# EAGLE design roco1044 (EAGLE 9.5.2)
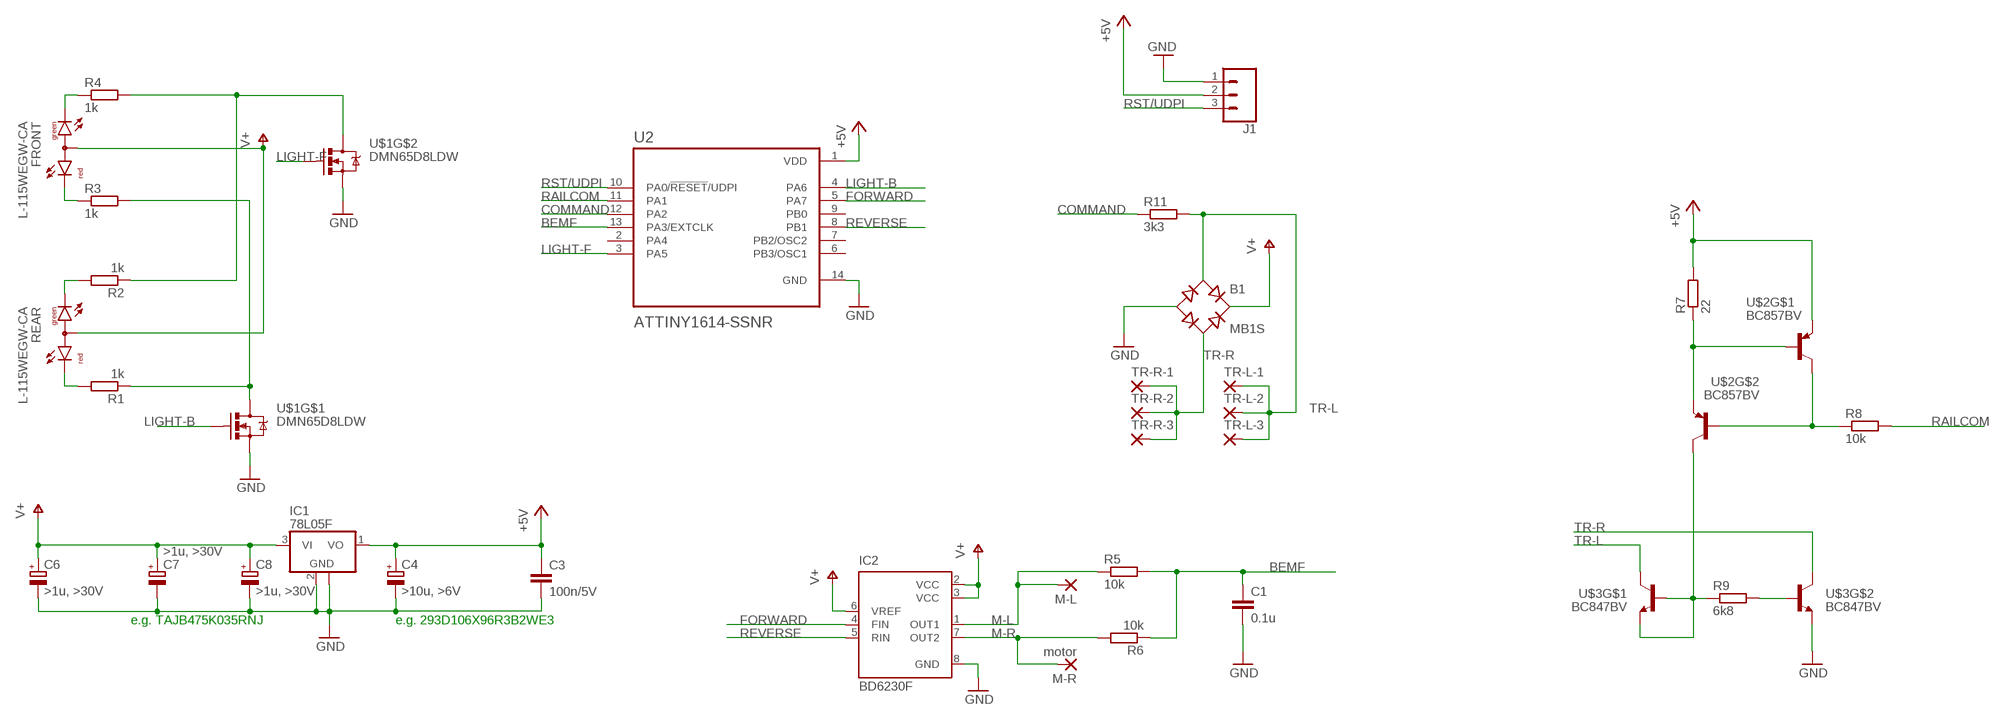
[diagram p0: schematic, sheet 1]

## Parts
B1  MB1S  [SOIC-4]
C1  0.1u  C-EUC0805  [C0805]
C3  100n/5V  C-EUC0805  [C0805]
C4  >10u, >6V  CPOL-EUCT3528  [CT3528]
C6  >1u, >30V  CPOL-EUCT3528  [CT3528]
C7  >1u, >30V  CPOL-EUCT3528  [CT3528]
C8  >1u, >30V  CPOL-EUCT3528  [CT3528]
FRONT  L-115WEGW-CA  [DUOLED-A-3MM]
IC1  78L05F  [SOT89]
IC2  BD6230F  [SOP8]
J1  455-1750-1-ND  CONN_03  [1X03]
M-L  SMD5  [SMD2,54-5,08]
M-R  motor  SMD5  [SMD2,54-5,08]
R1  1k  R-EU_R0805  [R0805]
R2  1k  R-EU_R0805  [R0805]
R3  1k  R-EU_R0805  [R0805]
R4  1k  R-EU_R0805  [R0805]
R5  10k  R-EU_R0805  [R0805]
R6  10k  R-EU_R0805  [R0805]
R7  22  R-EU_R0805  [R0805]
R8  10k  R-EU_R0805  [R0805]
R9  6k8  R-EU_R0805  [R0805]
R11  3k3  R-EU_R0805  [R0805]
REAR  L-115WEGW-CA  [DUOLED-A-3MM]
TR-L-1  SMD5  [SMD2,54-5,08]
TR-L-2  SMD5  [SMD2,54-5,08]
TR-L-3  SMD5  [SMD2,54-5,08]
TR-R-1  SMD5  [SMD2,54-5,08]
TR-R-2  SMD5  [SMD2,54-5,08]
TR-R-3  SMD5  [SMD2,54-5,08]
U2  ATTINY1614-SSNR  [SOIC127P600X175-14N]
U$1  DMN65D8LDW  [SOT363]
U$2  BC857BV  [SOT-666]
U$3  BC847BV  [SOT-666]

## Nets
+5V: C3.1 C4.+ IC1.1(VO) J1.2 R7.2 U2.1(VDD) U$2.P$1(E)
BEMF: C1.1 R5.2 R6.1 U2.13(PA3/EXTCLK)
COMMAND: R11.1 U2.12(PA2)
FORWARD: IC2.4(FIN) U2.5(PA7)
GND: B1.- C1.2 C3.2 C4.- C6.- C7.- C8.- IC1.2(GND) IC1.2@1(GND) IC2.8(GND) J1.1 U2.14(GND) U$1.P$3(S) U$1.P$6(S) U$3.P$4(E)
LIGHT-B: U2.4(PA6) U$1.P$2(G)
LIGHT-F: U2.3(PA5) U$1.P$5(G)
M-L: IC2.1(OUT1) M-L.1(P) R5.1
M-R: IC2.7(OUT2) M-R.1(P) R6.2
N$1: R9.2 U$3.P$5(B)
N$3: R9.1 U$2.P$3(C) U$3.P$1(E) U$3.P$2(B)
N$5: R2.1 R4.2 U$1.P$1(D)
N$6: R1.2 REAR.3(CR)
N$7: R2.2 REAR.1(CG)
N$8: R1.1 R3.2 U$1.P$4(D)
N$9: FRONT.3(CR) R3.1
N$10: FRONT.1(CG) R4.1
N$12: R7.1 U$2.P$2(B) U$2.P$4(E)
N$14: R8.1 U$2.P$5(B) U$2.P$6(C)
RAILCOM: R8.2 U2.11(PA1)
REVERSE: IC2.5(RIN) U2.8(PB1)
RST/UDPI: J1.3 U2.10(PA0/!RESET!/UDPI)
TR-L: B1.~1(AC1) R11.2 TR-L-1.1(P) TR-L-2.1(P) TR-L-3.1(P) U$3.P$6(C)
TR-R: B1.~2(AC2) TR-R-1.1(P) TR-R-2.1(P) TR-R-3.1(P) U$3.P$3(C)
V+: B1.+ C6.+ C7.+ C8.+ FRONT.2(A) IC1.3(VI) IC2.2(VCC) IC2.3(VCC) IC2.6(VREF) REAR.2(A)
Unconnected: U2.2(PA4) U2.6(PB3/OSC1) U2.7(PB2/OSC2) U2.9(PB0)

## Notes on the sheet
- e.g. TAJB475K035RNJ | e.g. 293D106X96R3B2WE3

## Library data of the parts
B1 = rectifier:MB*S: Bridge Rectifier Source: http://www.fairchildsemi.com/ds/MB/MB6S.pdf
C1 = resistor:C-EU: CAPACITOR, European symbol
C3 = rcl:C-EU: CAPACITOR, European symbol; SPICEPREFIX: C
C4 C6-C8 = rcl:CPOL-EU: POLARIZED CAPACITOR, European symbol; SPICEPREFIX: C
FRONT REAR = led:L-115WEGW-CA: T-1(3mm) BI-COLOR INDICATOR LAMP Source: Kingbright .. 2_colour_led_.pdf
IC1 = linear:78L*: POSITOIV-VOLTAGE REGULATORS Output up to 100 mA Source: Datasheet <http://focus.ti.com/lit/ds/symlink/ua78l05.pdf>
IC2 = rohm:BD623*F: H-bridge driver for brush motors Source: http://www.rohm.com/products/databook/motor/pdf/bd623x_series-e.pdf; MPN: BD6230F-E2; OC_FARNELL: 1716264; OC_NEWARK: 15R0529
J1 = SparkFun-Connectors:CONN_03: Multi connection point. Often used as Generic Header-pin footprint for 0.1 inch spaced/style header connections On any of the 0.1 inch spaced packages, you can populate with these: Break Away Headers - Straight <https://www.sparkfun.com/products/116> (PRT-00116) Break Away Male Headers - Right Angle <https://www.sparkfun.com/products/553> (PRT-00553) Female Headers <https://www.sparkfun.com/products/115> (PRT-00115) Break Away Headers - Machine Pin <https://www.sparkfun.com/products/117> (PRT-00117) Break Away Female Headers - Swiss Machine Pin <https://www.sparkfun.com/products/743> (PRT-00743) Stackable Header - 3 Pin (Female, 0.1") <https://www.sparkfun.com/products/13875> (PRT-13875) For SCREWTERMINALS and SPRING TERMINALS visit here: Screw Terimnals on SparkFun.com <https://www.sparkfun.com/search/results?term=Screw+Terminals> (5mm/3.5mm/2.54mm spacing) This device is also useful as a general connection point to wire up your design to another part of your project. Our various solder wires solder well into these plated through hole pads. Hook-Up Wire - Assortment (Stranded, 22 AWG) <https://www.sparkfun.com/products/11375> (PRT-11375) Hook-Up Wire - Assortment (Solid Core, 22 AWG) <https://www.sparkfun.com/products/11367> (PRT-11367) View the entire wire category on our website here <https://www.sparkfun.com/categories/141> Special notes: Molex polarized connector foot print use with SKU : PRT-08232 with associated crimp pins and housings.; PROD_ID: XXX-00000
M-L M-R TR-L-1-TR-L-3 TR-R-1-TR-R-3 = wirepad:SMD5: SMD PAD
R1-R9 R11 = rcl:R-EU_: RESISTOR, European symbol; SPICEPREFIX: R
U2 = ATTINY1614-SSNR:ATTINY1614-SSNR: 20MHz, SOIC, 85C, Green, 14 SOIC .150in T/R; AVAILABILITY: Unavailable; DESCRIPTION: AVR tinyAVR™ 1 Microcontroller IC 8-Bit 20MHz 16KB _16K x 8_ FLASH 14-SOIC; MF: Microchip; MP: ATTINY1614-SSNR; PACKAGE: SO-14 Microchip; PRICE: None
U$1 = Railstars:DMN65D8LDW
U$2 = Railstars:BC857BV
U$3 = Railstars:BC847BV

## Board
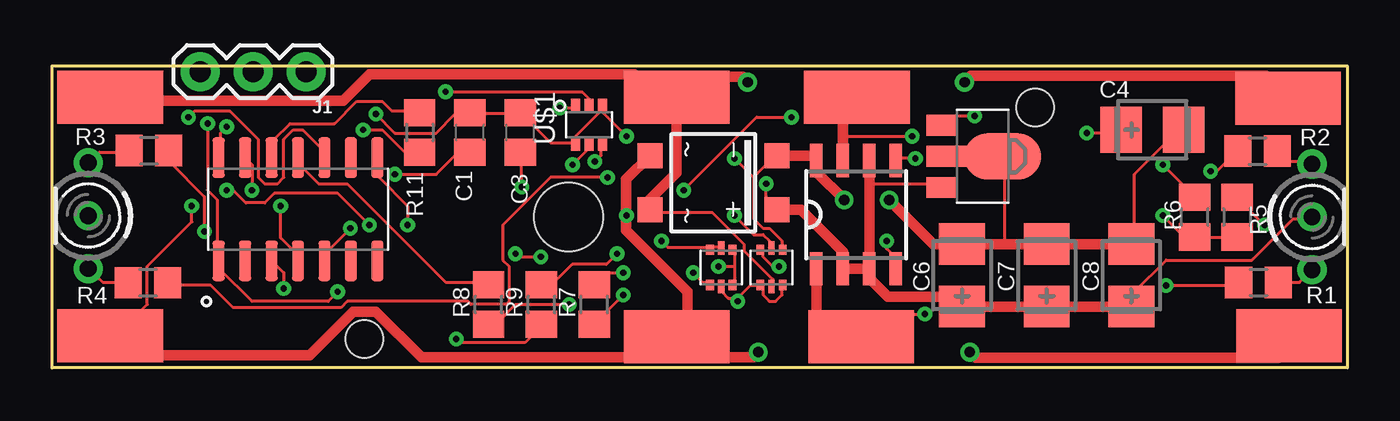
[diagram p1: board, top side]
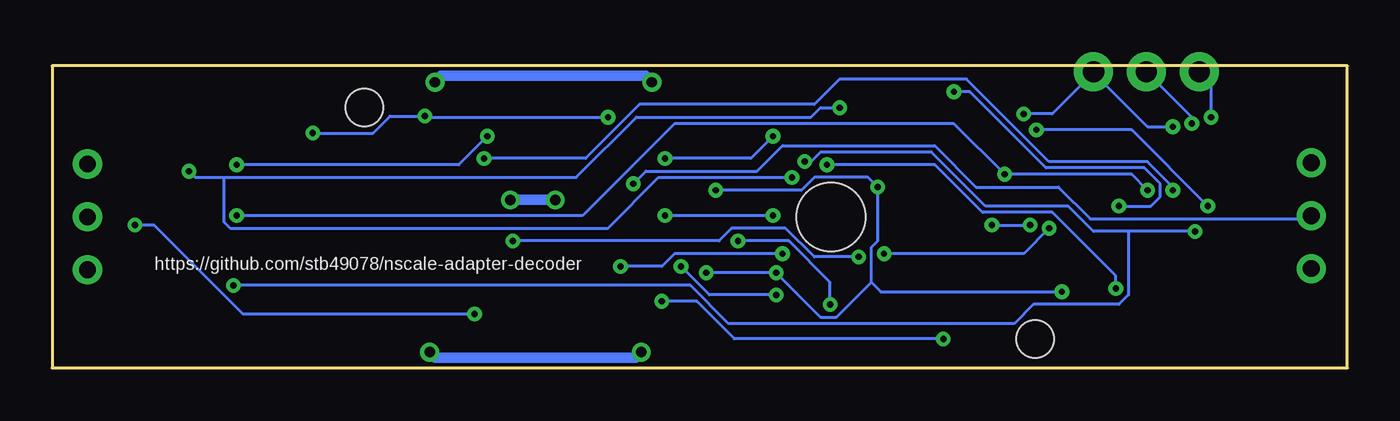
[diagram p2: board, bottom side, seen from below]

Size 62.2 x 14.5 mm. Coordinates in mm from the lower left corner, seen from the top.
Outline: 0,0 0,14.5 62.2,14.5 62.2,0 0,0
Copper layers (1*16): Top 0.035mm / dielectric 1.5mm / Bottom 0.035mm
Design rules "default *": minimum track width 6mil, minimum drill 0.3mm, track to track 6mil, track to pad 6mil, pad to pad 6mil, via to via 6mil, smd to smd 6mil, copper to edge 6mil, drill to drill 6mil, minimum pad ring 10mil, minimum via ring 8mil, stop-mask expansion 4mil, vias tented up to drill 0mil, thermal gap 10mil
Holes 1.8 mm at 15,1.4 47.2,12.5
Holes 3.3 mm at 24.8,7.25

### Footprints (pad centres in the part's own frame; a part is rotated, then mirrored left to right if it is on the bottom)
SOIC-4 = smd 1.2 x 1.2: + 1.3,3.05; - -1.3,3.05; ~1 -1.3,-3.05; ~2 1.3,-3.05
C0805 = smd 1.3 x 1.5: 1 -0.95,0; 2 0.95,0
CT3528 = smd 2 x 2.2: + -1.5,0; - 1.5,0
DUOLED-A-3MM = drill 0.8 pad 1.4: 1 -2.54,0; 2 0,0; 3 2.54,0
SOT89 = smd 1 x 1.5: 1 -1.499,-1.981; 3 1.499,-1.981 | smd 1 x 2: 2 0,-1.727 | smd 2.2 x 3.7: 2@1 0,0.94
SOP8 = smd 0.6 x 1.6: 1 -1.905,-2.6; 2 -0.635,-2.6; 3 0.635,-2.6; 4 1.905,-2.6; 5 1.905,2.6; 6 0.635,2.6; 7 -0.635,2.6; 8 -1.905,2.6
1X03 = drill 1.016 pad 1.88: 1 0,0; 2 2.54,0; 3 5.08,0
SMD2,54-5,08 = smd 2.54 x 5.08: 1 0,0
R0805 = smd 1.3 x 1.5: 1 -0.95,0; 2 0.95,0
SOIC127P600X175-14N = smd 1.95 x 0.59: 1 -2.48,3.81; 2 -2.48,2.54; 3 -2.48,1.27; 4 -2.48,0; 5 -2.48,-1.27; 6 -2.48,-2.54; 7 -2.48,-3.81; 8 2.48,-3.81; 9 2.48,-2.54; 10 2.48,-1.27; 11 2.48,0; 12 2.48,1.27; 13 2.48,2.54; 14 2.48,3.81
SOT363 = smd 0.42 x 0.6: P$1 -0.65,0.95; P$2 0,0.95; P$3 0.65,0.95; P$4 0.65,-0.95; P$5 0,-0.95; P$6 -0.65,-0.95
SOT-666 = smd 0.5 x 0.375: P$1 -0.85,0.537; P$2 -0.85,-0.537; P$4 0.85,-0.537; P$5 0.85,0.537 | smd 0.65 x 0.3: P$3 -0.925,0; P$6 0.925,0

### Placement (x,y rotation side)
B1  31.75,8.89 270 top
C1  20.07,11.3 90 top
C3  22.48,11.3 90 top
C4  52.83,11.43 0 top
C6  43.69,4.45 90 top
C7  47.75,4.45 90 top
C8  51.82,4.45 90 top
FRONT  1.74,7.31 90 top
IC1  44.7,10.16 270 top
IC2  38.61,7.37 0 top
J1  12.19,14.22 180 top
M-L  38.85,1.5 90 top
M-R  38.65,13 90 top
R1  57.92,4.1 0 top
R2  57.88,10.41 0 top
R3  4.65,10.43 0 top
R4  4.61,4.09 0 top
R5  56.9,7.24 270 top
R6  54.86,7.24 90 top
R7  26.04,3.05 90 top
R8  20.95,3.05 90 top
R9  23.5,3.05 90 top
R11  17.65,11.3 270 top
REAR  60.5,7.25 270 top
TR-L-1  2.8,1.55 90 top
TR-L-2  59.4,1.55 90 top
TR-L-3  30,1.5 270 top
TR-R-1  2.8,13 90 top
TR-R-2  59.35,12.95 270 top
TR-R-3  30,13 90 top
U2  11.81,7.62 90 top
U$1  25.78,11.68 0 top
U$2  32.13,4.83 90 top
U$3  34.54,4.83 90 top

### Tracks (layer width: path | path; a pad name or v marks a point on that pad's centre or on a via)
+5V  (via drill 0.3)
  Top 0.152: 51.05,11.28 51.21,11.43 C4.+ 51.05,11.28 | v7.47,11.73 7.47,8.53 7.92,8.08 7.92,5.18 U2.1 8.08,5.03 8.08,4.72 9.6,3.2 13.26,3.2 v13.72,3.66 | IC1.1 43.15,12.09 v44.3,12.09 | 51.05,11.28 v49.68,11.28 | v30.79,4.57 31.24,4.12 31.55,4.12 U$2.P$1 | v27.43,4.57 26.52,4.57 26.06,4.12 R7.2 | v22.55,8.69 22.55,10.21 C3.1 | v35.51,12.04 33.83,12.04 v30.33,8.53
  Bottom 0.152: v7.47,11.73 7.47,12.04 J1.2 | v49.68,11.28 46.79,11.28 45.97,12.09 v44.3,12.09 44.25,12.04 v35.51,12.04 | v30.79,4.57 v27.43,4.57 25.3,2.44 24.54,2.44 22.86,4.12 | 22.86,4.12 22.86,5.79 22.55,6.1 v22.55,8.69 23.01,9.14 25.6,9.14 26.21,8.53 v30.33,8.53 | v13.72,3.66 22.4,3.66 22.86,4.12
BEMF  (via drill 0.3)
  Top 0.152: R5.2 56.84,6.25 54.86,6.25 R6.1 54.86,6.4 54.25,6.4 v53.34,7.32 | v16.46,9.3 18.44,9.3 19.36,10.21 19.96,10.21 C1.1 | v9.6,8.53 9.6,9.75 9.3,10.06 U2.13
  Bottom 0.152: v9.6,8.53 10.36,9.3 v16.46,9.3 18.9,11.73 32.31,11.73 36.73,7.32 v53.34,7.32
COMMAND
  Top 0.152: R11.1 17.53,12.34 16.31,12.34 15.85,12.8 14.63,12.8 13.56,11.73 11.43,11.73 10.67,10.97 10.67,10.21 U2.12
FORWARD  (via drill 0.3)
  Top 0.152: IC2.4 40.51,5.28 40.08,5.71 v40.08,6.1 | v23.47,5.33 22.4,5.33 v22.25,5.49 | v14.33,6.71 13.11,5.49 13.11,5.18 U2.5
  Bottom 0.152: v40.08,6.1 30.18,6.1 29.57,6.71 26.98,6.71 25.6,5.33 v23.47,5.33 | v22.25,5.49 15.54,5.49 v14.33,6.71
GND  (via drill 0.3, 0.5)
  Top 0.152: 33.68,9.14 34.59,10.06 B1.- | IC1.2 43.13,10.21 45.57,10.21 IC1.2@1 45.72,10.06 45.72,5.95 | 33.68,9.14 33.68,7.16 34.14,6.71 34.44,6.71 35.05,6.1 35.05,5.79 U$3.P$4 | C4.- 53.8,11.43 53.8,11.12 51.97,9.3 51.97,6.1 C8.- | 26.36,12.34 26.52,12.5 U$1.P$3 26.36,12.34 | 26.36,12.34 25.15,11.12 25.15,10.82 U$1.P$6 24.99,10.82 23.93,10.82 22.55,12.19 C3.2 22.4,12.19 20.12,12.19 C1.2 19.96,12.19 19.36,12.19 18.44,11.28 16.46,11.28 v15.54,12.19 | v8.38,11.58 8.08,11.28 8.08,10.21 U2.14 | v32.77,10.06 33.68,9.14 | 26.36,12.34 v27.58,11.12
  Top 0.508: B1.- 36.48,10.19 IC2.8 36.7,9.4 v38.04,8.06 | C8.- C7.- 45.72,5.95 C6.- 42.31,5.95 v40.2,8.06
  Bottom 0.152: v8.38,11.58 9.6,11.58 12.19,14.17 | v15.54,12.19 14.17,12.19 12.19,14.17 | 12.19,14.17 J1.1 | v32.77,10.06 28.65,10.06 v27.58,11.12
  Bottom 0.508: v40.2,8.06 38.16,8.06 38.1,8 v38.04,8.06
LIGHT-B  (via drill 0.3)
  Top 0.152: v18.9,13.26 25.45,13.26 25.76,12.95 25.76,12.65 U$1.P$2 | v10.97,7.77 10.97,6.25 11.73,5.49 11.73,5.18 U2.4
  Bottom 0.152: v18.9,13.26 18.14,13.26 14.48,9.6 9.75,9.6 8.99,8.84 8.99,8.23 9.45,7.77 v10.97,7.77
LIGHT-F  (via drill 0.3)
  Top 0.152: v24.99,9.75 25.76,10.52 25.76,10.67 U$1.P$5 | v11.12,3.81 11.12,4.57 10.67,5.03 U2.3
  Bottom 0.152: v24.99,9.75 19.81,9.75 17.53,7.47 14.17,7.47 11.12,4.42 v11.12,3.81
M-L  (via drill 0.3)
  Top 0.152: v58.22,6.86 57,8.08 R5.1 | v41.91,2.59 39.93,2.59 39.01,1.68 M-L.1
  Top 0.508: M-L.1 36.85,1.5 36.7,1.65 IC2.1
  Bottom 0.152: v58.22,6.86 57.3,6.86 53.03,2.59 v41.91,2.59
M-R  (via drill 0.3)
  Top 0.152: 37.97,12.95 38.56,12.95 M-R.1 | v53.34,9.75 54.86,8.23 R6.2 | 37.97,11.12 v41.3,11.12
  Top 0.508: IC2.7 37.97,11.12 37.97,12.95
  Bottom 0.152: v53.34,9.75 42.67,9.75 v41.3,11.12
N$1  (via drill 0.3)
  Top 0.152: v34.9,4.88 34.59,4.88 34.14,5.33 34.14,5.64 U$3.P$5 | v27.13,5.49 26.62,4.98 24.97,4.98 24.11,4.12 23.62,4.12 R9.2
  Bottom 0.152: v34.9,4.88 32.92,4.88 32.31,5.49 v27.13,5.49
N$3  (via drill 0.3)
  Top 0.152: 32.16,3.66 32.16,3.81 U$2.P$3 32.16,3.66 | 32.92,3.35 33.53,3.96 33.98,3.96 U$3.P$1 34.14,3.96 34.14,3.5 34.44,3.2 34.75,3.2 35.05,3.5 35.05,3.96 U$3.P$2 | 32.92,3.35 32.46,3.35 32.16,3.66 | v32.92,3.2 32.92,3.35 | v19.41,1.4 19.58,1.22 22.71,1.22 23.47,1.98 R9.1
  Bottom 0.152: v32.92,3.2 31.24,3.2 29.44,1.4 v19.41,1.4
N$5  (via drill 0.3)
  Top 0.152: v24.38,12.5 24.99,12.5 U$1.P$1 | v55.63,9.45 55.93,9.45 56.84,10.36 R2.1 | v26.67,9.14 23.93,9.14 21.64,6.86 21.64,5.18 21.95,4.88 21.95,3.2 21.79,3.05 20.12,3.05 19.96,3.2 14.17,3.2 13.87,2.9 8.69,2.9 7.62,3.96 5.64,3.96 R4.2
  Bottom 0.152: v24.38,12.5 25.3,12.5 25.76,12.04 34.14,12.04 37.03,9.14 53.95,9.14 | 53.95,9.14 55.32,9.14 v55.63,9.45 | v26.67,9.14 33.07,9.14 35.51,6.71 53.65,6.71 53.95,7.01 53.95,9.14
N$6
  Top 0.152: R1.2 59.89,4.1 59.89,4.12 60.35,4.57 REAR.3
N$7
  Top 0.152: R2.2 59.28,9.91 60.35,9.91 REAR.1
N$8  (via drill 0.3)
  Top 0.152: v26.06,9.91 26.36,10.21 26.36,10.67 U$1.P$4 | v7.32,6.55 7.32,8.23 5.64,9.91 5.64,10.36 R3.2 | v53.49,3.96 56.84,3.96 R1.1
  Bottom 0.152: v26.06,9.91 25.76,9.91 25.3,10.36 19.96,10.36 17.37,7.77 13.41,7.77 12.19,6.55 10.52,6.55 | v7.32,6.55 10.52,6.55 | v53.49,3.96 31.55,3.96 29.72,2.13 16,2.13 15.09,3.05 10.97,3.05 10.52,3.5 10.52,6.55
N$9
  Top 0.152: R3.1 3.66,10.36 2.29,10.36 1.83,9.91 FRONT.3
N$10
  Top 0.152: R4.1 3.5,4.12 2.44,4.12 1.83,4.72 FRONT.1
N$12  (via drill 0.3)
  Top 0.152: 32.77,4.88 32.77,5.64 U$2.P$4 | 32.77,4.88 32.77,4.12 U$2.P$2 | v32,4.88 32.77,4.88 | v27.43,3.5 26.06,2.13 R7.1
  Bottom 0.152: v32,4.88 30.63,3.5 v27.43,3.5
N$14  (via drill 0.3)
  Top 0.152: U$2.P$6 32,5.79 31.7,5.79 U$2.P$5 31.55,5.79 29.57,5.79 v29.26,6.1 | v24.84,3.05 22.25,3.05 21.34,2.13 21.03,2.13 R8.1
  Bottom 0.152: v29.26,6.1 26.82,6.1 24.84,4.12 v24.84,3.05
RAILCOM
  Top 0.152: R8.2 20.88,4.12 18.9,4.12 14.17,8.84 12.8,8.84 11.89,9.75 11.89,10.06 U2.11
REVERSE  (via drill 0.3)
  Top 0.152: v41.45,10.06 40.54,10.06 IC2.5 | v8.38,8.53 8.69,8.53 9.3,7.92 10.21,7.92 10.67,8.38 13.72,8.38 v15.24,6.86 | v17.07,6.86 17.07,7.77 15.7,9.14 15.7,10.06 U2.8
  Bottom 0.152: v41.45,10.06 36.58,10.06 33.98,12.65 25.6,12.65 24.38,13.87 18.29,13.87 14.33,9.91 9.6,9.91 8.38,8.69 v8.38,8.53 | v17.07,6.86 v15.24,6.86
RST/UDPI  (via drill 0.3)
  Top 0.152: v6.55,12.04 6.86,12.34 8.53,12.34 9.91,10.97 9.91,9.14 10.21,8.84 10.82,8.84 11.12,9.14 11.12,10.97 11.58,11.43 12.04,11.43 12.95,10.52 12.95,10.21 U2.10
  Bottom 0.152: v6.55,12.04 6.55,13.72 7.01,14.17 J1.3
TR-L  (via drill 0.3, 0.5)
  Top 0.152: v32.77,7.32 33.68,6.4 34.14,6.4 34.44,6.1 34.44,5.79 U$3.P$6 | v27.58,7.32 27.56,7.32 | v14.94,11.43 15.85,11.43 16.92,10.36 17.53,10.36 R11.2 | v6.71,7.77 6.71,7.01 4.57,4.88 4.57,3.05 3.05,1.52 TR-L-1.1
  Top 0.508: B1.~1 27.56,9.05 27.56,7.32 27.56,6.61 30.51,3.66 30.51,2.01 TR-L-3.1 30.36,1.14 | TR-L-2.1 59.05,1.21 59.05,0.64 58.9,0.48 44.35,0.48 v44.07,0.76 | v33.91,0.76 33.66,0.51 30.99,0.51 30.36,1.14 | TR-L-1.1 3.74,0.61 12.36,0.61 14.46,2.71 15.54,2.71 17.74,0.51 30.1,0.51 30.36,0.77 30.36,1.14
  Bottom 0.152: v27.58,7.32 v32.77,7.32 | v14.94,11.43 10.36,11.43 v6.71,7.77
  Bottom 0.508: v44.07,0.76 43.79,0.48 34.19,0.48 v33.91,0.76
TR-R  (via drill 0.5)
  Top 0.152: U$3.P$3 34.59,3.96 34.59,4.27 33.22,5.64 33.22,5.94 31.7,7.47 28.8,7.47 B1.~2
  Top 0.508: B1.~2 28.7,8.1 29.97,9.37 29.97,12.97 TR-R-3.1 | TR-R-3.1 30.99,13.97 33.15,13.97 v33.4,13.72 | TR-R-2.1 58.28,14.02 44.12,14.02 v43.81,13.72 | TR-R-3.1 28.98,11.98 28.98,13.05 27.94,14.1 15.24,14.1 13.97,12.83 2.97,12.83 TR-R-1.1
  Bottom 0.508: v43.81,13.72 43.51,14.02 33.7,14.02 v33.4,13.72
V+  (via drill 0.3)
  Top 0.152: IC1.3 | IC1.3 42.55,8.84 39.24,8.84 | 51.97,3.66 51.97,3.05 C8.+ 51.97,3.66 | 51.97,3.66 53.49,5.18 57.61,5.18 59.59,7.16 60.35,7.16 REAR.2 | v34.29,8.84 34.29,8.23 34.75,7.77 B1.+
  Top 0.508: IC2.6 39.24,8.84 IC2.3 | IC2.3 IC2.2 37.97,5.59 35.97,7.59 B1.+ | IC2.3 39.24,4.32 40.13,3.43 43.2,3.43 C6.+ C7.+ C8.+
  Bottom 0.152: v34.29,8.84 33.68,9.45 28.35,9.45 27.13,10.67 19.81,10.67 17.83,8.69 13.87,8.69 12.34,7.16 1.83,7.16 FRONT.2

### Text on the board
bNames: https://github.com/stb49078/nscale-adapter-decoder